# Altium schematic sheet shield.SchDoc
size A4; SheetNumber: 1; SheetTotal: 2
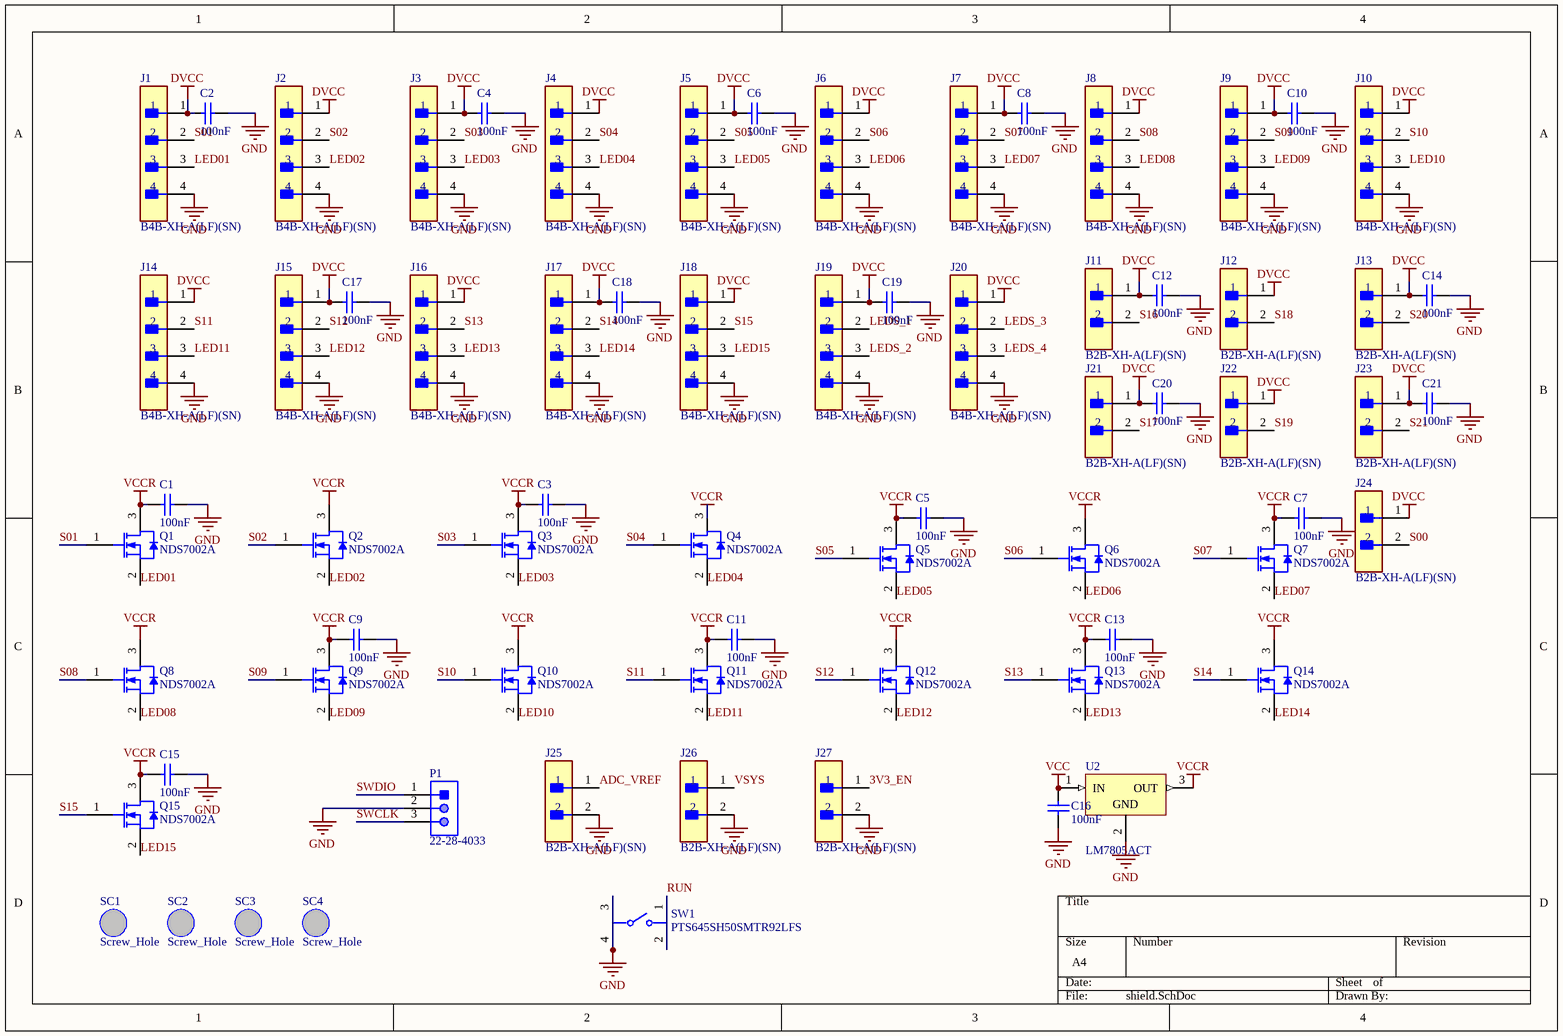
[diagram p0: shield.SchDoc]

## Parts
C1  100nF  [0805C]
C2  100nF  [0805C]
C3  100nF  [0805C]
C4  100nF  [0805C]
C5  100nF  [0805C]
C6  100nF  [0805C]
C7  100nF  [0805C]
C8  100nF  [0805C]
C9  100nF  [0805C]
C10  100nF  [0805C]
C11  100nF  [0805C]
C12  100nF  [0805C]
C13  100nF  [0805C]
C14  100nF  [0805C]
C15  100nF  [0805C]
C16  100nF  [0805C]
C17  100nF  [0805C]
C18  100nF  [0805C]
C19  100nF  [0805C]
C20  100nF  [0805C]
C21  100nF  [0805C]
J1  B4B-XH-A(LF)(SN)  [FP-B4B-XH-A_LF_SN-MFG]
J2  B4B-XH-A(LF)(SN)  [FP-B4B-XH-A_LF_SN-MFG]
J3  B4B-XH-A(LF)(SN)  [FP-B4B-XH-A_LF_SN-MFG]
J4  B4B-XH-A(LF)(SN)  [FP-B4B-XH-A_LF_SN-MFG]
J5  B4B-XH-A(LF)(SN)  [FP-B4B-XH-A_LF_SN-MFG]
J6  B4B-XH-A(LF)(SN)  [FP-B4B-XH-A_LF_SN-MFG]
J7  B4B-XH-A(LF)(SN)  [FP-B4B-XH-A_LF_SN-MFG]
J8  B4B-XH-A(LF)(SN)  [FP-B4B-XH-A_LF_SN-MFG]
J9  B4B-XH-A(LF)(SN)  [FP-B4B-XH-A_LF_SN-MFG]
J10  B4B-XH-A(LF)(SN)  [FP-B4B-XH-A_LF_SN-MFG]
J11  B2B-XH-A(LF)(SN)  [FP-B2B-XH-A_LF_SN-MFG]
J12  B2B-XH-A(LF)(SN)  [FP-B2B-XH-A_LF_SN-MFG]
J13  B2B-XH-A(LF)(SN)  [FP-B2B-XH-A_LF_SN-MFG]
J14  B4B-XH-A(LF)(SN)  [FP-B4B-XH-A_LF_SN-MFG]
J15  B4B-XH-A(LF)(SN)  [FP-B4B-XH-A_LF_SN-MFG]
J16  B4B-XH-A(LF)(SN)  [FP-B4B-XH-A_LF_SN-MFG]
J17  B4B-XH-A(LF)(SN)  [FP-B4B-XH-A_LF_SN-MFG]
J18  B4B-XH-A(LF)(SN)  [FP-B4B-XH-A_LF_SN-MFG]
J19  B4B-XH-A(LF)(SN)  [FP-B4B-XH-A_LF_SN-MFG]
J20  B4B-XH-A(LF)(SN)  [FP-B4B-XH-A_LF_SN-MFG]
J21  B2B-XH-A(LF)(SN)  [FP-B2B-XH-A_LF_SN-MFG]
J22  B2B-XH-A(LF)(SN)  [FP-B2B-XH-A_LF_SN-MFG]
J23  B2B-XH-A(LF)(SN)  [FP-B2B-XH-A_LF_SN-MFG]
J24  B2B-XH-A(LF)(SN)  [FP-B2B-XH-A_LF_SN-MFG]
J25  B2B-XH-A(LF)(SN)  [FP-B2B-XH-A_LF_SN-MFG]
J26  B2B-XH-A(LF)(SN)  [FP-B2B-XH-A_LF_SN-MFG]
J27  B2B-XH-A(LF)(SN)  [FP-B2B-XH-A_LF_SN-MFG]
P1  22-28-4033  [MOLX-22-28-4033_V]
Q1  NDS7002A  [FAIR-SOT23-3_V]
Q2  NDS7002A  [FAIR-SOT23-3_V]
Q3  NDS7002A  [FAIR-SOT23-3_V]
Q4  NDS7002A  [FAIR-SOT23-3_V]
Q5  NDS7002A  [FAIR-SOT23-3_V]
Q6  NDS7002A  [FAIR-SOT23-3_V]
Q7  NDS7002A  [FAIR-SOT23-3_V]
Q8  NDS7002A  [FAIR-SOT23-3_V]
Q9  NDS7002A  [FAIR-SOT23-3_V]
Q10  NDS7002A  [FAIR-SOT23-3_V]
Q11  NDS7002A  [FAIR-SOT23-3_V]
Q12  NDS7002A  [FAIR-SOT23-3_V]
Q13  NDS7002A  [FAIR-SOT23-3_V]
Q14  NDS7002A  [FAIR-SOT23-3_V]
Q15  NDS7002A  [FAIR-SOT23-3_V]
SC1  Screw_Hole  [Screw_Hole]
SC2  Screw_Hole  [Screw_Hole]
SC3  Screw_Hole  [Screw_Hole]
SC4  Screw_Hole  [Screw_Hole]
SW1  PTS645SH50SMTR92LFS  [FP-PTS645SH50SMTR92LFS-MFG]
U2  LM7805ACT  [FAIR-TO-220-3]

## Nets
DVCC: C2.1 C4.1 C6.1 C8.1 C10.1 C12.1 C14.1 C17.1 C18.1 C19.1 C20.1 C21.1 J1.1 J2.1 J3.1 J4.1 J5.1 J6.1 J7.1 J8.1 J9.1 J10.1 J11.1 J12.1 J13.1 J14.1 J15.1 J16.1 J17.1 J18.1 J19.1 J20.1 J21.1 J22.1 J23.1 J24.1
GND: C1.2 C2.2 C3.2 C4.2 C5.2 C6.2 C7.2 C8.2 C9.2 C10.2 C11.2 C12.2 C13.2 C14.2 C15.2 C16.1 C17.2 C18.2 C19.2 C20.2 C21.2 J1.4 J2.4 J3.4 J4.4 J5.4 J6.4 J7.4 J8.4 J9.4 J10.4 J14.4 J15.4 J16.4 J17.4 J18.4 J19.4 J20.4 J25.2 J26.2 J27.2 P1.2 SW1.3 SW1.4 U2.2(GND)
VCC: C16.2 U2.1(IN)
VCCR: C1.1 C3.1 C5.1 C7.1 C9.1 C11.1 C13.1 C15.1 Q1.3(D) Q2.3(D) Q3.3(D) Q4.3(D) Q5.3(D) Q6.3(D) Q7.3(D) Q8.3(D) Q9.3(D) Q10.3(D) Q11.3(D) Q12.3(D) Q13.3(D) Q14.3(D) Q15.3(D) U2.3(OUT)
3V3_EN: J27.1
ADC_VREF: J25.1
LED01: J1.3 Q1.2(S)
LED02: J2.3 Q2.2(S)
LED03: J3.3 Q3.2(S)
LED04: J4.3 Q4.2(S)
LED05: J5.3 Q5.2(S)
LED06: J6.3 Q6.2(S)
LED07: J7.3 Q7.2(S)
LED08: J8.3 Q8.2(S)
LED09: J9.3 Q9.2(S)
LED10: J10.3 Q10.2(S)
LED11: J14.3 Q11.2(S)
LED12: J15.3 Q12.2(S)
LED13: J16.3 Q13.2(S)
LED14: J17.3 Q14.2(S)
LED15: J18.3 Q15.2(S)
LEDS_1: J19.2
LEDS_2: J19.3
LEDS_3: J20.2
LEDS_4: J20.3
RUN: SW1.1 SW1.2
S00: J24.2
S01: J1.2 Q1.1(G)
S02: J2.2 Q2.1(G)
S03: J3.2 Q3.1(G)
S04: J4.2 Q4.1(G)
S05: J5.2 Q5.1(G)
S06: J6.2 Q6.1(G)
S07: J7.2 Q7.1(G)
S08: J8.2 Q8.1(G)
S09: J9.2 Q9.1(G)
S10: J10.2 Q10.1(G)
S11: J14.2 Q11.1(G)
S12: J15.2 Q12.1(G)
S13: J16.2 Q13.1(G)
S14: J17.2 Q14.1(G)
S15: J18.2 Q15.1(G)
S16: J11.2
S17: J21.2
S18: J12.2
S19: J22.2
S20: J13.2
S21: J23.2
SWCLK: P1.3
SWDIO: P1.1
VSYS: J26.1

## Library data of the parts
C1-C21 = C: Capacitor; Reviewed by: RM - 2018/08/05; Revision: July-2002: Re-released for DXP Platform.; Supplier 1: *; Supplier Part Number 1: *; Value: 100nF
J1-J10 J14-J20 = CMP-17439-000250-1: CONN HEADER VERT 4POS 2.5MM; Number of Contacts: 4; Contact Resistance: 20mR; Voltage Rating: 250V; Max Current Rating: 3A; Gender: Male; Wire/Cable Gauge: 22AWG; Mated Stacking Heights: 9.8mm; Insulation Resistance: 1GR; Orientation: Straight; Contact Type: Male Pin; Contact Finish - Mating: TIN; Series: XH; Max Voltage Rating (AC): 250V; Lead Pitch: 2.5mm; Contact Shape: Square; Insulation Color: Natural; Termination: Solder; Lead Free: Lead Free; Voltage Rating (AC): 250V; Number of Rows: 1; Flammability Rating: UL94 V-0; Number of Positions: 4; Max Operating Temperature: 85°C; Package Quantity: 500; Mount: Through Hole; REACH SVHC: No SVHC; Connector Type: Header; Insulation Material: Nylon; Fastening Type: Detent; Min Operating Temperature: -25°C; Housing Color: White; Packaging: Bulk; Contact Plating: Tin; Contact Material: Brass; Max Voltage Rating (DC): 250V; Housing Material: Polyamide; Color: Natural; Material: Polyamide; Pitch: 2.5mm; Depth: 5.75mm; Current Rating: 3A; Length: 12.4mm
J11-J13 J21-J27 = CMP-2000-05888-3: CONN HEADER VERT 2POS 2.5MM; Current Rating: 3A; Voltage Rating: 250V; Number of Contacts: 2; Contact Resistance: 20mR; Wire/Cable Gauge: 22AWG; Insulation Resistance: 1GR; Connector Type: Male Pin; Packaging: Bulk; Contact Material: Brass; Lead Free: Lead Free; Orientation: Straight; Contact Plating: Tin; Max Current Rating: 3A; Termination: Solder; Fastening Type: Detent; Depth: 5.75mm; Housing Material: Polyamide; REACH SVHC: No SVHC; Series: XH; Voltage Rating (AC): 250V; Number of Positions: 2; Color: Natural; Contact Type: Male Pin; Max Voltage Rating (DC): 250V; Pitch: 2.5mm; Lead Pitch: 2.5mm; Mount: Through Hole; Max Operating Temperature: 85°C; Length: 7.4mm; Max Voltage Rating (AC): 250V; Min Operating Temperature: -25°C; Number of Rows: 1; Housing Color: White
P1 = CMP-1676-00001-5: Male Header, Pitch 2.54 mm, 1 x 3 Position, Height 8.38 mm, Tail Length 3.18 mm, RoHS, Bulk; Manufacturer: Molex; Rows: 1; Voltage Rating: 250 V; Current Rating: 4 A; Min Operating Temperature: 0 degC; Lead Pitch: 0.1 inch; Packaging: Bulk; Contact Finish: Gold; RoHSCompliant: true; Contact Material: Brass; PackageReference: 22-28-4033; REACH SVHC: Unknown; PackageDescription: Male Header, Pitch 2.54 mm, 1 x 3 Position, Height 8.38 mm, Tail Length 3.18 mm; ComponentLink2URL: http://www.molex.com/pdm_docs/sd/022284033_sd.pdf; Height: 8.38 mm; Mounting Technology: Through Hole; ComponentLink1Description: Manufacturer URL; Length: 7.62 mm; Mount: Through Hole; DatasheetVersion: Rev. G, 01/2012; Max Operating Temperature: 75 degC; ComponentLink2Description: Datasheet; Colour: Black; Pins: 3; Contact Plating: Gold; Package Quantity: 1; ComponentLink1URL: http://www.molex.com/
Q1-Q15 = CMP-2000-06836-1: N-Channel Enhancement Mode Field Effect Transistor, 60 V, 280 mA, -65 to 150 degC, 3-Pin SOT23 (TO-236AB), RoHS, Tape and Reel; Manufacturer: Fairchild Semiconductor; On Resistance Rds(on): 2ohm; Voltage Vgs th Max: 2.5V; Transistor Case Style: SOT-23; Continuous Drain Current Id: 280mA; Full Power Rating Temperature: 25°C; Threshold Voltage Vgs: 2.1V; Package Version: Rev. 12, 03/2016; No. of Pins: 3; External Width: 3.05mm; SMD Marking: 712; Voltage Vgs Rds on Measurement: 10V; Voltage Vds Typ: 60V; External Depth: 2.5mm; Transistor Polarity: NChannel; Pulse Current Idm: 1.5A; Power Dissipation Pd: 300mW; SVHC: NoSVHC(16-Jun-2014); External Length / Height: 1.12mm; No. of Transistors: 1; Packaging: CutTape; Operating Temperature Min: -65°C; Tape Width: 8mm; MSL: MSL1-Unlimited; Device Marking: NDS7002A; Mounting Technology: SurfaceMount; Voltage Vgs Max: 2.1V; Operating Temperature Range: -65°Cto+150°C; Current Id Max: 280mA; Operating Temperature Max: 150°C; Manufacturer URL: https://www.fairchildsemi.com/; Datasheet URL: https://www.fairchildsemi.com/datasheets/ND/NDS7002A.pdf; Rds(on) Test Voltage Vgs: 10V; Drain Source Voltage Vds: 60V; Package Reference: SOT23-3; Current Temperature: 25°C; Package URL: http://www.fairchildsemi.com/dwg/MA/MA03D.pdf; Package Description: 3-Pin Small Outline Transistor, Body 2.92 x 1.325 mm, Pitch 0.95 mm; Datasheet Version: Rev. 2.10, 08/2016
SC1-SC4 = Screw_Hole: Screw Hole
SW1 = CMP-10040-000028-1: SWITCH TACTILE SPST-NO 0.05A 12V; Operating Force: 200gf; Current Rating: 50mA; Illumination Type: Non-Illuminated; Actuator Material: Nylon; Throw Configuration: SPST; Switch Function: Off-Mom; Mechanical Life: 100000Cycles; Actuator Type: Standard; Packaging: Tape and Reel; Termination: Gull Wing; Max Operating Temperature: 60°C; Length: 6mm; REACH SVHC: No SVHC; Orientation: Straight; Max Voltage Rating (DC): 12V; Package Quantity: 1000; Max Current Rating: 50mA; Mount: Surface Mount; Contact Material: Bronze; Case/Package: SMD/SMT; Lead Free: Lead Free; Min Operating Temperature: -20°C; Contact Plating: Silver; Color: Black; Depth: 9mm; Voltage Rating (DC): 12V
U2 = CMP-2000-04937-1: Positive Voltage Regulator, 5 V, 1 A, 0 to 125 degC, 3-Pin TO-220, RoHS, Tube; Manufacturer: Fairchild; Number of Outputs: 1; Typical Dropout Voltage @ Current: 2V@1A; Output Type: Fixed; Output Voltage: 5V; Quiescent Current: 6mA; Dropout Voltage Measurement Current: 1A; Line Regulation: 50mV; Maximum Input Voltage: 35V; Regulator Function: Linear; Load Regulation: 100mV; Package Type: TO-220; Mounting Type: ThroughHole; Height: 16.51mm; Maximum Operating Temperature: +125degC; Datasheet Version: Rev. 1.0.1, 05/2006; Package Reference: TO-220; Minimum Operating Temperature: 0degC; Manufacturer URL: https://www.fairchildsemi.com/; Package URL: https://www.fairchildsemi.com/package-drawings/TO/TO220B03.pdf; Length: 10.67mm; Series: LM78xx; Dimensions: 10.67x4.83x16.51mm; Polarity: Positive; Maximum Output Current: 1A; Pin Count: 3; Width: 4.83mm; Package Description: 3-Pin Through Hole Device, Body 10 x 4.5 mm, Pitch 2.54 mm; Datasheet URL: https://datasheet.ciiva.com/5816/1359194-5816420.pdf